# Altium schematic sheet RS232-MITM.SchDoc
size A4
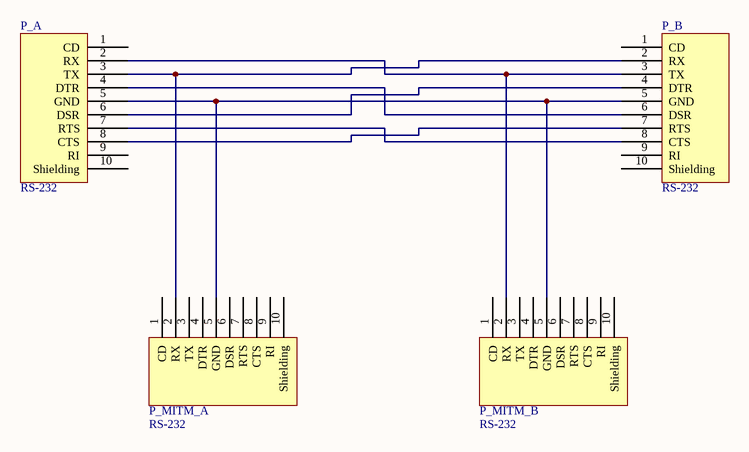
[diagram p0: RS232-MITM.SchDoc]

## Parts
P_A  RS-232  [RS-232]
P_B  RS-232  [RS-232]
P_MITM_A  RS-232  [RS-232 mirrored]
P_MITM_B  RS-232  [RS-232 mirrored]

## Nets
NetP_A_2: P_A.2(RX) P_B.3(TX) P_MITM_B.2(RX)
NetP_A_3: P_A.3(TX) P_B.2(RX) P_MITM_A.2(RX)
NetP_A_4: P_A.4(DTR) P_B.6(DSR)
NetP_A_5: P_A.5(GND) P_B.5(GND) P_MITM_A.5(GND) P_MITM_B.5(GND)
NetP_A_6: P_A.6(DSR) P_B.4(DTR)
NetP_A_7: P_A.7(RTS) P_B.8(CTS)
NetP_A_8: P_A.8(CTS) P_B.7(RTS)

Not connected (* = marked no-connect by the designer): P_A 1(CD) 9(RI) 10(Shielding); P_B 1(CD) 9(RI) 10(Shielding); P_MITM_A 1(CD) 3(TX) 4(DTR) 6(DSR) 7(RTS) 8(CTS) 9(RI) 10(Shielding); P_MITM_B 1(CD) 3(TX) 4(DTR) 6(DSR) 7(RTS) 8(CTS) 9(RI) 10(Shielding)